# Altium schematic sheet Actuators.SchDoc: Smart Street Light System - Actuators Schematic Doc
size 431 x 279 mm; Author: Arvind Balaji Narayan, Gopik Anand; CompanyName: Cats_and_Dogs; Engineer: Arvind Balaji Narayan, Gopik Anand; Organization: University of Pennsylvania
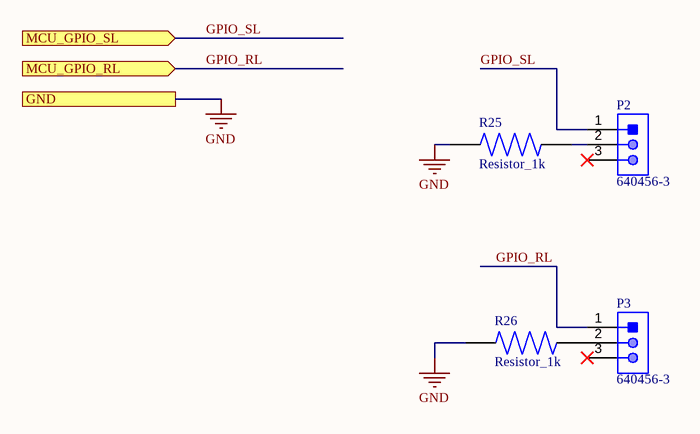
[diagram p0: Actuators.SchDoc]

## Parts
P2  640456-3  [TECO-640456-3]
P3  640456-3  [TECO-640456-3]
R25  Resistor_1k  [Resistor_1k]
R26  Resistor_1k  [Resistor_1k]

## Ports
GND, MCU_GPIO_RL (in), MCU_GPIO_SL (in)

## Nets
GND: R25.1 R26.1 ; port GND
GPIO_RL: P3.1 ; port MCU_GPIO_RL
GPIO_SL: P2.1 ; port MCU_GPIO_SL
NetP2_2: P2.2 R25.2
NetP3_2: P3.2 R26.2

Not connected (* = marked no-connect by the designer): P2 3*; P3 3*

## Notes on the sheet
- DWG. NO.
- REV.
- SHT.
- THIS DOCUMENT AND THE DATA DISCLOSED HEREIN OR HEREWITH IS THE PROPERTY OF ALTIUM LIMITED AND MAY BE FREELY DISTRIBUTED IN WHOLE. NO RIGHTS ARE RESERVED OR EXPRESS OR IMPLIED WARANTEE GIVEN.
- REVISION
- DESCRIPTION
- DATE
- APPROVED
- ENG:
- APPROVALS
- PROJECT
- DSN:
- CHK:
- REFERENCE DOCUMENTS
- PROJECT REVISION:
- TITLE
- DOCUMENT REVISION:
- DESIGN ITEM:
- BOM:
- FAB DWG:
- PCB DWG:
- ASSY DWG:
- SCALE:
- SIZE
- B
- CAGE CODE
- FILE NAME
- DWG NO.
- SHEET
- OF
- REV

## Library data of the parts
P2 P3 = CMP-2000-05418-1: Male Header, Pitch 2.54 mm, 1 x 3 Position, Height 10.03 mm, Tail Length 3.56 mm, -55 to 105 degC; Manufacturer: TE Connectivity; Agency Approvals: CSA,UL; Angle: Straight; Number of Positions: 3; Standards: RoHSCompliant,ELVCompliant,UL94V-0; Current, Rating: 5 / A; Connector Type: MTA-100; Mount Angle: Vertical; Material, Housing: Polyester; Temperature, Operating: -55to+105 / degC; Voltage, Rating: 250 / V; Color, Housing: White; Contact Centerline Spacing: 0.100 / in.; Special Features: Pinstrip; Material, Contact: CopperAlloy; Contact Termination Area Plating: Tin; Primary Type: InterconnectSystem; Pin Spacing: 0.1 / "; Brand/Series: MTA-100Series; Mounting Hole Size: 0.04 / "; Manufacturer URL: http://www.te.com/; Datasheet URL: https://datasheet.ciiva.com/16456/eng-ds-82056-mta-0608-16456886.pdf; Flammability Rating: UL94V-0; Mounting Type: PCMount; Contact Mating Area Plating: Tin; Datasheet Version: Jun-08; Number of Rows: 1; Termination: Solder; Type: PCBPlug; Length, Pin: 0.14 / "; Color: White; Contact Plating: Tin; Contact Shape: Square; Number of Contacts: 3; Size, Post: 0.025 / in.; Length, Terminal Post: 0.14 / in.; Length, Overall: 0.3 / "
R25 R26 = Resistor_1k: Res Thick Film 0603 1K Ohm 1% 0.1W(1/10W) ±100ppm/C Pad SMD Automotive T/R; Manufacturer: TE Connectivity; Manufacturer Part Number: 1-2176092-8; Resistance: 1kR; Tolerance: 0.1%; Power Rating: 250mW; Temperature Coefficient: 25ppm/°C; Voltage Rating: 150V; Number of Resistors: 1; Supplier 1: Digi-Key; Supplier Part Number 1: A110543CT-ND; RoHS: Yes; Category: Chip SMD Resistors; Stock 1: 9833; Pricing 1: 1=0.64000, 10=0.47400, 100=0.27590 (USD); Mount: Surface Mount; Case/Package: 0805; Case Code (Metric): 2012; Case Code (Imperial): 0805; Min Operating Temperature: -55°C; Max Operating Temperature: 155°C; Packaging: Tape and Reel; Resistor Type: Thin Film; Termination: Solder; Package Quantity: 1000; Number of Terminations: 2; Max Power Dissipation: 250mW; Length: 0.079inch; Width: 0.049inch; Height: 0.026inch; RoHS Compliant: Yes; Lead Free: Lead Free; ComponentLink1URL: https://datasheet.ciiva.com/41821/eng-ds-1773272-j-41821837.pdf?src-supplier=Digi-Key; ComponentLink1Description: https://datasheet.ciiva.com/41821/eng-ds-1773272-j-41821837.pdf?src-supplier=Digi-Key; ComponentLink2URL: https://datasheet.ciiva.com/41823/eng-ds-1773272-j-41823324.pdf?src-supplier=Digi-Key; ComponentLink2Description: https://datasheet.ciiva.com/41823/eng-ds-1773272-j-41823324.pdf?src-supplier=Digi-Key; ComponentLink3URL: https://datasheet.ciiva.com/41808/eng-ds-1773272-j-41808533.pdf?src-supplier=Digi-Key; ComponentLink3Description: https://datasheet.ciiva.com/41808/eng-ds-1773272-j-41808533.pdf?src-supplier=Digi-Key; Supplier 2: Digi-Key; Supplier Part Number 2: RMCF0603FT1K00CT-ND; Stock 2: 2; Pricing 2: 1=0.10000, 10=0.01700, 100=0.00680, 1000=0.00305, 2500=0.00264 (USD); Contact Plating: Tin,Matte; Size Code: 0603; Features: Automotive AEC-Q200; Series: RMCF; Construction: Rectangular; Depth: 0.8mm; Radiation Hardening: No; Military Standard: Not; ComponentLink4URL: https://www.seielect.com/catalog/sei-rmcf_rmcp.pdf?src-supplier=Digi-Key; ComponentLink4Description: https://www.seielect.com/catalog/sei-rmcf_rmcp.pdf?src-supplier=Digi-Key; ComponentLink5URL: https://www.seielect.com/catalog/SEI-RMCF_RMCP.pdf?src-supplier=Avnet; ComponentLink5Description: https://www.seielect.com/catalog/SEI-RMCF_RMCP.pdf?src-supplier=Avnet; ComponentLink6URL: https://www.seielect.com/catalog/SEI-Packaging.pdf?src-supplier=Avnet; ComponentLink6Description: https://www.seielect.com/catalog/SEI-Packaging.pdf?src-supplier=Avnet; ComponentLink7URL: https://www.seielect.com/catalog/SEI-Packaging.pdf?src-supplier=Arrow+Electronics; ComponentLink7Description: https://www.seielect.com/catalog/SEI-Packaging.pdf?src-supplier=Arrow+Electronics; ComponentLink8URL: https://www.seielect.com/catalog/SEI-RMCF_RMCP.pdf?src-supplier=Avnet+Asia; ComponentLink8Description: https://www.seielect.com/catalog/SEI-RMCF_RMCP.pdf?src-supplier=Avnet+Asia; ComponentLink9URL: http://www.seielect.com/Catalog/SEI-rmc.pdf?src-supplier=Future+Electronics; ComponentLink9Description: http://www.seielect.com/Catalog/SEI-rmc.pdf?src-supplier=Future+Electronics; ComponentLink10URL: https://www.seielect.com/catalog/SEI-Packaging.pdf?src-supplier=Verical; ComponentLink10Description: https://www.seielect.com/catalog/SEI-Packaging.pdf?src-supplier=Verical; ComponentLink11URL: https://www.seielect.com/catalog/SEI-Packaging.pdf?src-supplier=Quest; ComponentLink11Description: https://www.seielect.com/catalog/SEI-Packaging.pdf?src-supplier=Quest